# Altium schematic sheet RasPi-BplusHAT-RELAY.SchDoc
size 409 x 282 mm; >DRAWING_NAME: RasPi-BplusHAT.sch; >LAST_DATE_TIME: 08-Jan-17 10:29:30 AM; >SHEET: 1; Sheet:: Sheet:
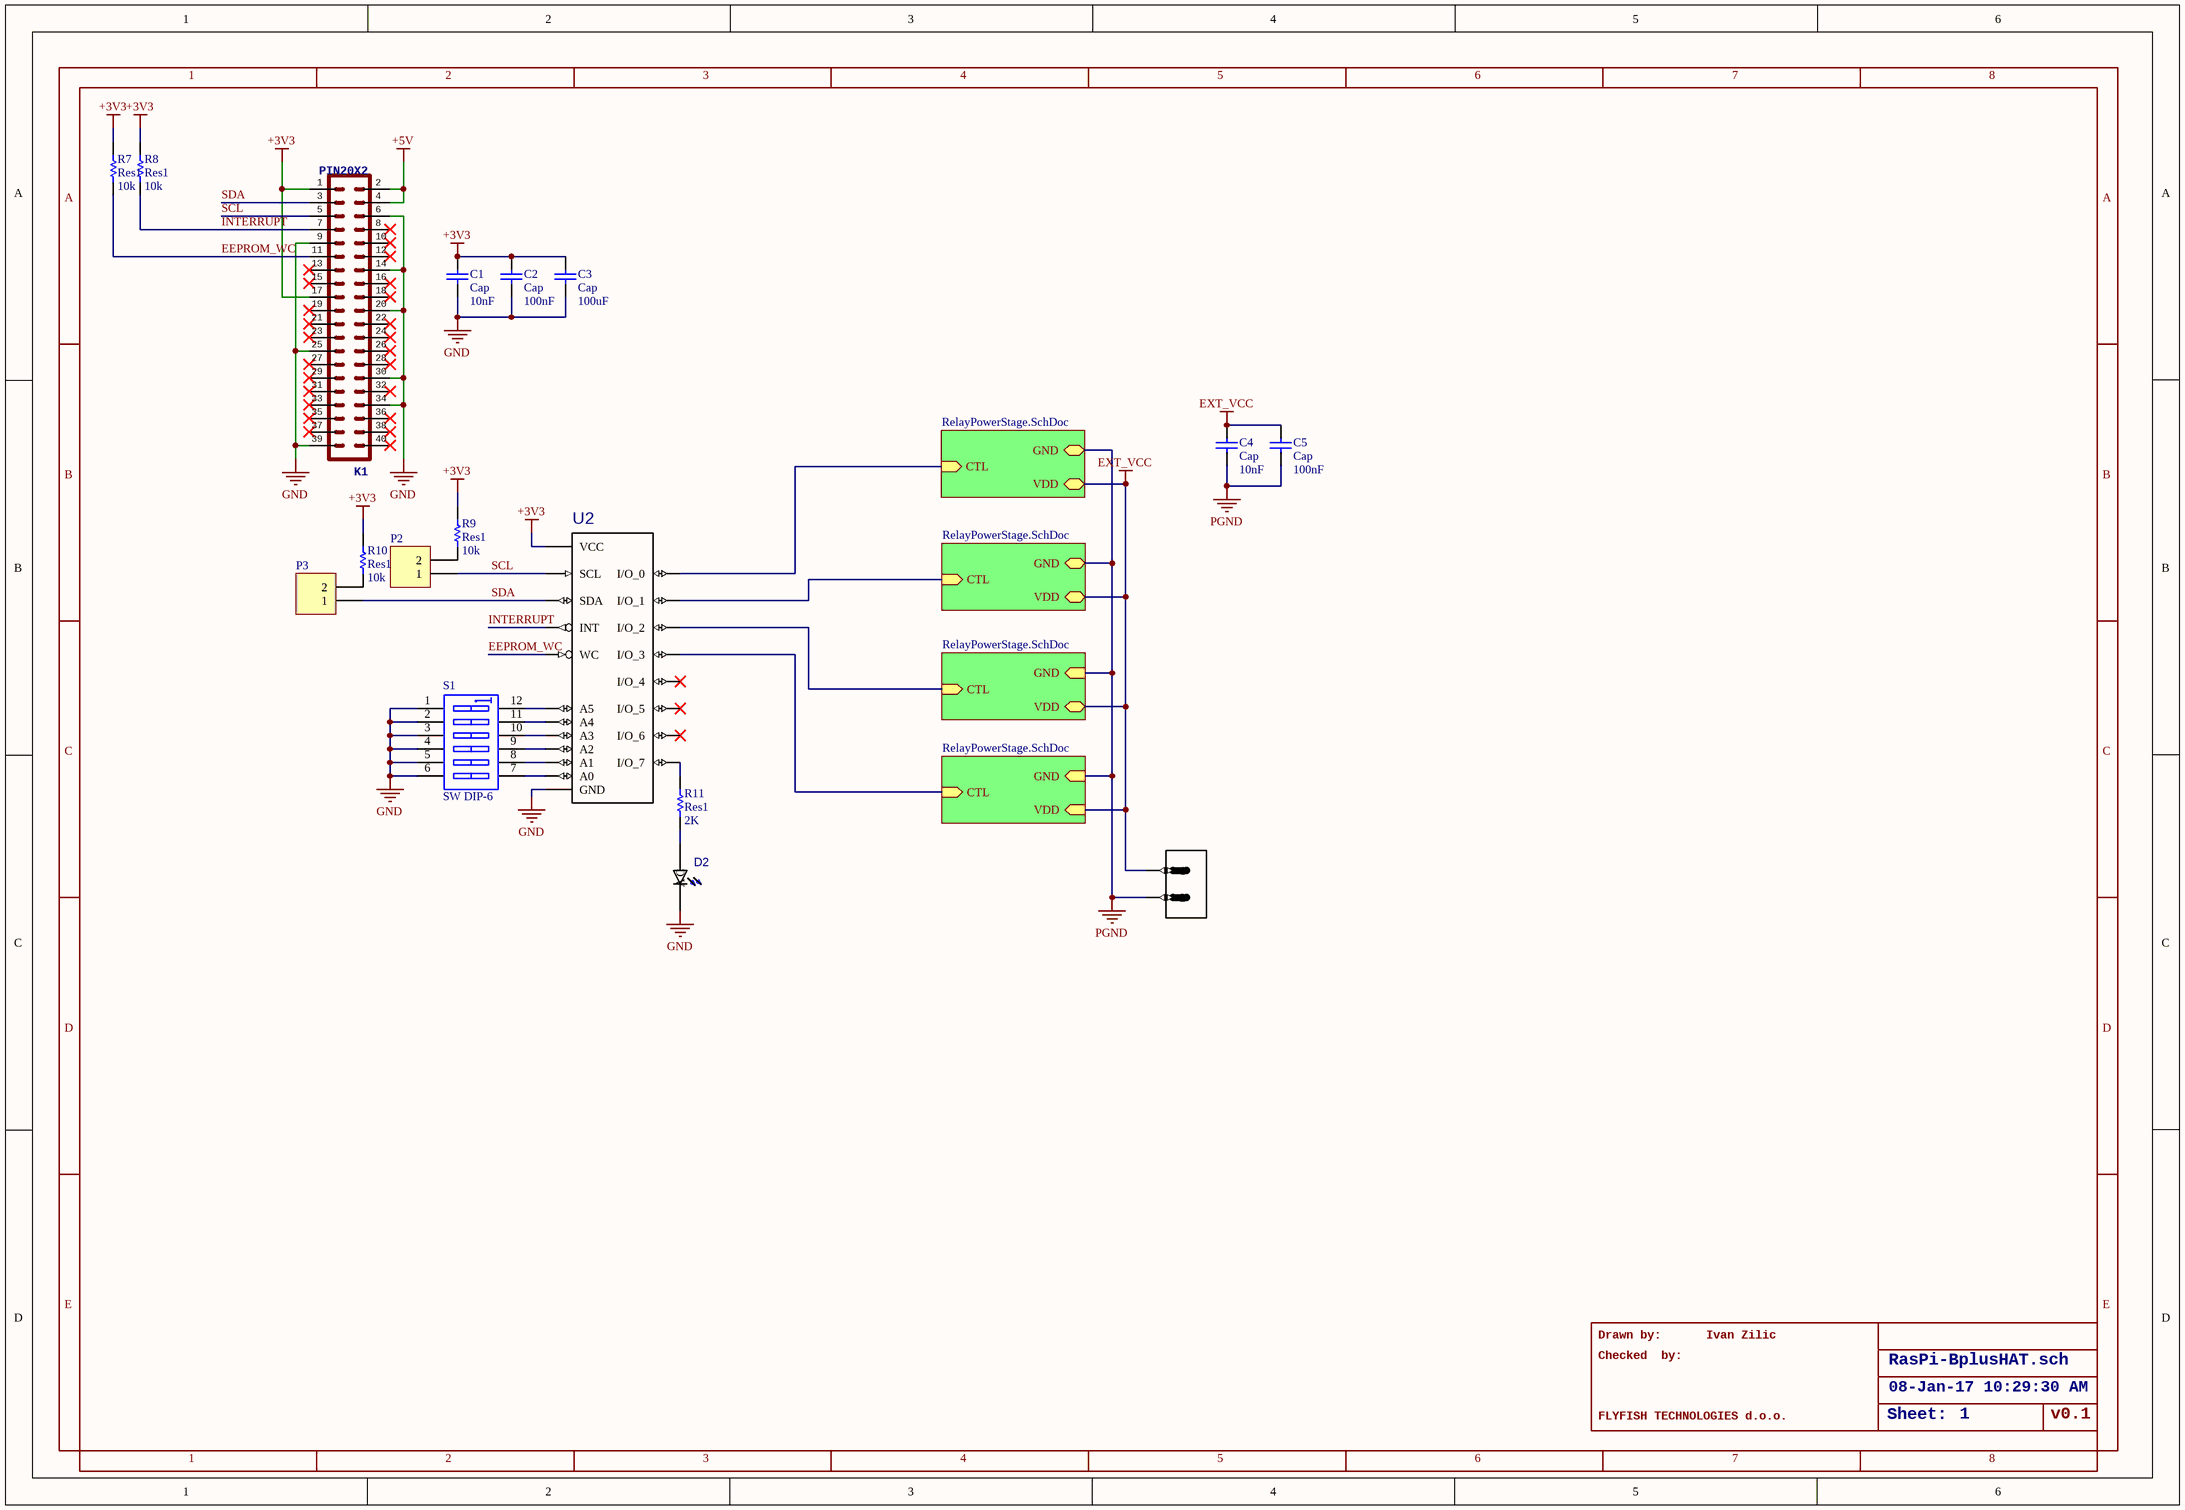
[diagram p0: RasPi-BplusHAT-RELAY.SchDoc]

## Parts
C1  Cap  value 10nF  [6-0805_N]
C2  Cap  value 100nF  [6-0805_N]
C3  Cap  value 100uF  [6-0805_N]
C4  Cap  value 10nF  [6-0805_N]
C5  Cap  value 100nF  [6-0805_N]
D2  0805_LED  [LEDSC200X125X70-2N_598-8160-107F(Primary)]  (value not drawn)
J2  1760510000  [1760490000]  (value not drawn)
K1  >NAME: K1  [HDR2X20]  (hidden comment: PIN20X2)
P2  Header 2  [HDR1X2]  (value not drawn)
P3  Header 2  [HDR1X2]  (value not drawn)
R7  Res1  value 10k  [6-0805_N]
R8  Res1  value 10k  [6-0805_N]
R9  Res1  value 10k  [6-0805_N]
R10  Res1  value 10k  [6-0805_N]
R11  Res1  value 2K  [6-0805_N]
S1  SW DIP-6  [DIP-12/SW]
U2  PCA9501  [TSSOP20]  (value not drawn)

## Sub-sheets
RM = RelayPowerStage.SchDoc: VDD (bidir), GND (bidir), CTL (in)
RM = RelayPowerStage.SchDoc: VDD (bidir), GND (bidir), CTL (in)
RM = RelayPowerStage.SchDoc: VDD (bidir), GND (in), CTL (in)
RM = RelayPowerStage.SchDoc: VDD (in), GND (in), CTL (in)

## Nets
+3V3: C1.2 C2.2 C3.2 K1.1 K1.17 R7.1 R8.1 R9.1 R10.1 U2.20(VCC)
+5V: K1.2 K1.4
EXT_VCC: C4.2 C5.2 J2.1 ; sheet RM/VDD, sheet RM/VDD, sheet RM/VDD, sheet RM/VDD
GND: C1.1 C2.1 C3.1 D2.C K1.6 K1.9 K1.14 K1.20 K1.25 K1.30 K1.34 K1.39 S1.1(A1) S1.2(A2) S1.3(A3) S1.4(A4) S1.5(A5) S1.6(A6) U2.10(GND)
PGND: C4.1 C5.1 J2.2 ; sheet RM/GND, sheet RM/GND, sheet RM/GND, sheet RM/GND
EEPROM_WC: K1.11 R7.2 U2.17(WC)
INTERRUPT: K1.7 R8.2 U2.8(INT)
SCL: K1.5 P2.1 U2.18(SCL)
SDA: K1.3 P3.1 U2.19(SDA)
NetD2_A: D2.A R11.2
NetP2_2: P2.2 R9.2
NetP3_2: P3.2 R10.2
NetR11_1: R11.1 U2.16(I/O_7)
NetS1_7: S1.7(B6) U2.1(A0)
NetS1_8: S1.8(B5) U2.2(A1)
NetS1_9: S1.9(B4) U2.3(A2)
NetS1_10: S1.10(B3) U2.12(A3)
NetS1_11: S1.11(B2) U2.11(A4)
NetS1_12: S1.12(B1) U2.9(A5)
NetU2_4: U2.4(I/O_0) ; sheet RM/CTL
NetU2_5: U2.5(I/O_1) ; sheet RM/CTL
NetU2_6: U2.6(I/O_2) ; sheet RM/CTL
NetU2_7: U2.7(I/O_3) ; sheet RM/CTL

Not connected (* = marked no-connect by the designer): K1 8* 10* 12* 13* 15* 16* 18* 19* 21* 22* 23* 24* 26* 27* 28* 29* 31* 32* 33* 35* 36* 37* 38* 40*; U2 13(I/O_4)* 14(I/O_5)* 15(I/O_6)*

## Notes on the sheet
- Drawn by:
- Checked  by:
- Ivan Zilic
- FLYFISH TECHNOLOGIES d.o.o.
- v0.1
- 1
- 2
- 3
- 4
- 5
- 6
- 7
- 8
- A
- B
- C
- D
- E

## Library data of the parts
C1-C5 = Cap: Capacitor; Published: 8-Jun-2000; LatestRevisionDate: 17-Jul-2002; LatestRevisionNote: Re-released for DXP Platform.; PackageReference: RAD-0.3; Publisher: Altium Limited; PackageDescription: Radial Cap, Thru-Hole; 2 Leads; 0.3 in Pin Spacing
D2 = 598-8160-107F: LED, SMD; 0805; Yellow-Green; Water Clear Lens; 40mcd; 570/575nm; MF: Dialight; Package: 0805 Dialight; MP: 598-8160-107F; Price: 0.09 USD; Availability: Good; Value: *
J2 = 1760510000: Conn Terminal Block 2 POS 5.08mm Solder ST Thru-Hole 16A; MF: Weidmuller; Package: None; MP: 1760510000; Price: 0.43 USD; Availability: Good; Value: *
P2 P3 = Header 2: Header, 2-Pin; LatestRevisionDate: 17-Jul-2002; LatestRevisionNote: Re-released for DXP Platform.; Publisher: Altium Limited
R7-R11 = Res1: Resistor; Published: 8-Jun-2000; LatestRevisionDate: 17-Jul-2002; LatestRevisionNote: Re-released for DXP Platform.; PackageReference: AXIAL-0.3; Publisher: Altium Limited; PackageDescription: Axial Device, Thru-Hole; 2 Leads; 0.3 in Pin Spacing
S1 = SW DIP-6: DIP Switch, 6 Position, SPST; Published: 24-Mar-1999; LatestRevisionDate: 17-Jul-2002; LatestRevisionNote: Re-released for DXP Platform.; PackageReference: DIP-12/SW; Publisher: Altium Limited; PackageDescription: DIP Switch; 12 Leads
U2 = PCA9501: MF: NXP Semiconductors; MP: PCA9501; Package: None; Availability: Unavailable; Price: None; Value: *
K1 = PIN20X2: >VALUE: PIN20X2